# Altium schematic sheet MCU.SchDoc: MVU
size A3; DocumentNumber: 4; SheetNumber: 4; SheetTotal: 6
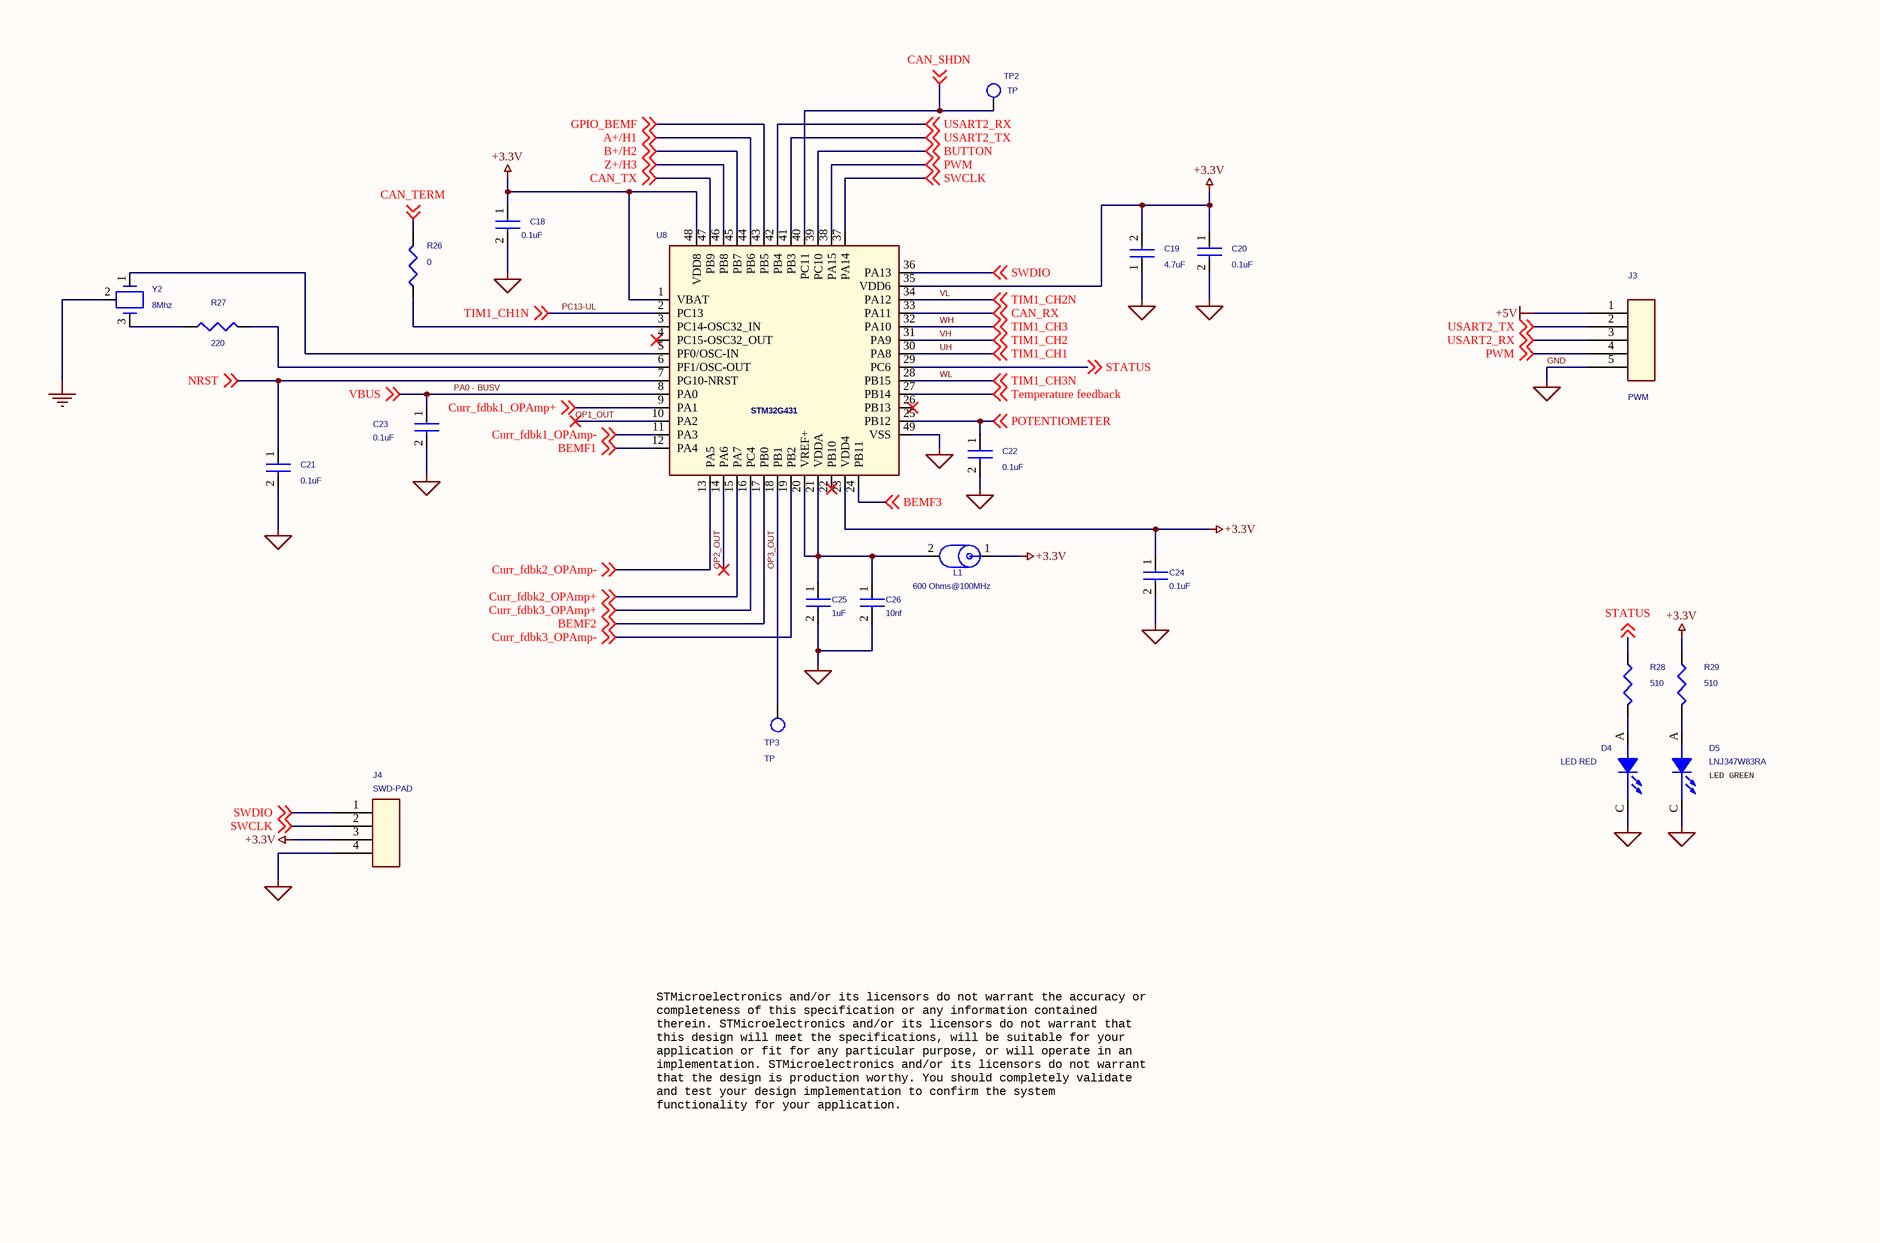
[diagram p0: MCU.SchDoc, top left]
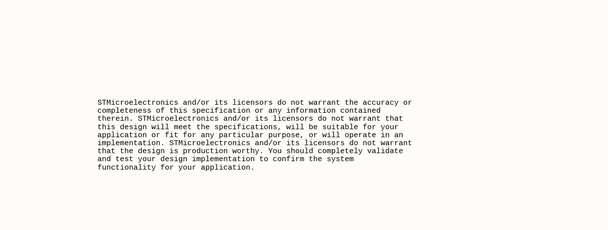
[diagram p1: MCU.SchDoc, bottom right]

## Parts
C18  0.1uF  [C_0402]
C19  4.7uF  [C_0603]
C20  0.1uF  [C_0402]
C21  0.1uF  [C_0402]
C22  0.1uF  [C_0402]
C23  0.1uF  [C_0402]
C24  0.1uF  [C_0402]
C25  1uF  [C_0402]
C26  10nf  [C_0402]
D4  LED RED  [D_0402_Led_red]
D5  LNJ347W83RA  [D_0402_Led_green]
J3  PWM  [SOLDER_PAD_5PIN_SMD]
J4  SWD-PAD  [SOLDER_PAD_4PIN_rect_SMD]
L1  600 Ohms@100MHz  [L_0402]
R26  0  [R_0402]
R27  220  [R_0402]
R28  510  [R_0402]
R29  510  [R_0402]
TP2  TP  [test_point_100_smd]
TP3  TP  [test_point_100_smd]
U8  STM32G431  [qfn49p50_700x700x60l40x25t560n]
Y2  8Mhz  [murata_cstce8m00g15c99-r0]

## Nets
+3.3V: C18.1 C19.2 C20.1 C24.1 J4.3 L1.1 R29.1 U8.1(VBAT) U8.23(VDD4) U8.35(VDD6) U8.48(VDD8)
+5V: J3.1
GND: C18.2 C19.1 C20.2 C21.2 C22.2 C23.2 C24.2 C25.2 C26.2 D4.C(CATHODE) D5.C(CATHODE) J3.5 J4.4 U8.49(VSS) Y2.2  [also labelled GND_SIGNAL]
A+/H1: U8.44(PB6) ; off-sheet A+/H1
B+/H2: U8.45(PB7) ; off-sheet B+/H2
BEMF1: U8.12(PA4) ; off-sheet BEMF1
BEMF2: U8.17(PB0) ; off-sheet BEMF2
BEMF3: U8.24(PB11) ; off-sheet BEMF3
BUTTON: U8.39(PC10) ; off-sheet BUTTON
CAN_RX: U8.33(PA11) ; off-sheet CAN_RX
CAN_SHDN: TP2.1 U8.40(PC11) ; off-sheet CAN_SHDN
CAN_TERM: R26.2 ; off-sheet CAN_TERM
CAN_TX: U8.47(PB9) ; off-sheet CAN_TX
Curr_fdbk1_OPAmp+: U8.9(PA1) ; off-sheet Curr_fdbk1_OPAmp+
Curr_fdbk1_OPAmp-: U8.11(PA3) ; off-sheet Curr_fdbk1_OPAmp-
Curr_fdbk2_OPAmp+: U8.15(PA7) ; off-sheet Curr_fdbk2_OPAmp+
Curr_fdbk2_OPAmp-: U8.13(PA5) ; off-sheet Curr_fdbk2_OPAmp-
Curr_fdbk3_OPAmp+: U8.16(PC4) ; off-sheet Curr_fdbk3_OPAmp+
Curr_fdbk3_OPAmp-: U8.19(PB2) ; off-sheet Curr_fdbk3_OPAmp-
GPIO_BEMF: U8.43(PB5) ; off-sheet GPIO_BEMF
NRST: C21.1 U8.7(PG10-NRST) ; off-sheet NRST
OP1_OUT: U8.10(PA2)
OP2_OUT: U8.14(PA6)
OP3_OUT: TP3.1 U8.18(PB1)
PA0 - BUSV: C23.1 U8.8(PA0) ; off-sheet VBUS  [also labelled VBUS]
PC13-UL: U8.2(PC13) ; off-sheet TIM1_CH1N  [also labelled TIM1_CH1N]
POTENTIOMETER: C22.1 U8.25(PB12) ; off-sheet POTENTIOMETER
PWM: J3.4 U8.38(PA15) ; off-sheet PWM
STATUS: R28.1 U8.29(PC6) ; off-sheet STATUS
SWCLK: J4.2 U8.37(PA14) ; off-sheet SWCLK
SWDIO: J4.1 U8.36(PA13) ; off-sheet SWDIO
Temperature feedback: U8.27(PB14) ; off-sheet Temperature feedback
UH: U8.30(PA8) ; off-sheet TIM1_CH1  [also labelled TIM1_CH1]
USART2_RX: J3.3 U8.42(PB4) ; off-sheet USART2_RX
USART2_TX: J3.2 U8.41(PB3) ; off-sheet USART2_TX
VH: U8.31(PA9) ; off-sheet TIM1_CH2  [also labelled TIM1_CH2]
VL: U8.34(PA12) ; off-sheet TIM1_CH2N  [also labelled TIM1_CH2N]
WH: U8.32(PA10) ; off-sheet TIM1_CH3  [also labelled TIM1_CH3]
WL: U8.28(PB15) ; off-sheet TIM1_CH3N  [also labelled TIM1_CH3N]
Z+/H3: U8.46(PB8) ; off-sheet Z+/H3
NetC25_1: C25.1 C26.1 L1.2 U8.20(VREF+) U8.21(VDDA)
NetD4_A: D4.A(ANODE) R28.2
NetD5_A: D5.A(ANODE) R29.2
NetR26_1: R26.1 U8.3(PC14-OSC32_IN)
NetR27_1: R27.1 Y2.3
NetR27_2: R27.2 U8.6(PF1/OSC-OUT)
NetU8_5: U8.5(PF0/OSC-IN) Y2.1

Not connected (* = marked no-connect by the designer): U8 4(PC15-OSC32_OUT)* 22(PB10)* 26(PB13)*

## Notes on the sheet
- (near D5) LED GREEN
- STMicroelectronics and/or its licensors do not warrant the accuracy or
  completeness of this specification or any information contained
  therein. STMicroelectronics and/or its licensors do not warrant that
  this design will meet the specifications, will be suitable for your
  application or fit for any particular purpose, or will operate in an
  implementation. STMicroelectronics and/or its licensors do not warrant
  that the design is production worthy. You should completely validate
  and test your design implementation to confirm the system
  functionality for your application.
- Title:
- Project:
- Size:
- Revision:
- Variant:
- A3
- -
- Date:
- Reference:
- Sheet:
- of

## Library data of the parts
C18 C22 = CAP_Dup1: CAP CER 0.1UF 16V X7R 0402; PART_NUMBER: CAP-00000053; Manufacturer: Wurth Electronics Inc.; Manufacturer PN: 885012205037; Dielectric Type: Capacitors; Tolerance: 10%; CLASS: DISCRETE; Package Size: 0402 (1005 Metric); Temperature Coefficient: X7R; Rated Voltage: 16V
C19 = CAP_Dup1: CAP CER 4.7UF 10V X5R 0603; Manufacturer PN: 885012106012; Manufacturer: Wurth Electronics Inc.; PART_NUMBER: TMP-414; CLASS: DISCRETE; Tolerance: 20%; Dielectric Type: Capacitors; Rated Voltage: 10V; Temperature Coefficient: X5R; Package Size: 0603 (1608 Metric)
C20 C21 C23 C24 = CAP_Dup1: CAP CER 0.1UF 16V X7R 0402; Manufacturer PN: 885012205037; Manufacturer: Wurth Electronics Inc.; PART_NUMBER: CAP-00000053; CLASS: DISCRETE; Tolerance: 10%; Dielectric Type: Capacitors; Rated Voltage: 16V; Temperature Coefficient: X7R; Package Size: 0402 (1005 Metric)
C25 = CAP_Dup1: CAP CER 1UF 25V X5R 0402; PART_NUMBER: CAP-00000006; Manufacturer: Murata Electronics North America; Manufacturer PN: GRM155R61E105KA12D; Dielectric Type: Capacitors; Tolerance: 10%; CLASS: DISCRETE; Package Size: 0402 (1005 Metric); Temperature Coefficient: X5R; Rated Voltage: 25V
C26 = CAP_Dup1: CAP CER 10000PF 16V X7R 0402; PART_NUMBER: TMP-422; Manufacturer: Wurth Electronics Inc.; Manufacturer PN: 885012205031; Dielectric Type: Capacitors; Tolerance: 10%; CLASS: DISCRETE; Package Size: 0402 (1005 Metric); Temperature Coefficient: X7R; Rated Voltage: 16V
D4 = LED: DIO, Rectangle with Flat Top, 1.00mm x 0.50mm, VLMS1500-GS08, 20mA, --, --, 0402 (1005 Metric); PART_NUMBER: DIO-00000003; Manufacturer: Vishay Semiconductor Opto Division; CLASS: DISCRETE; Package Size: 0402 (1005 Metric); Manufacturer PN: VLMS1500-GS08
D5 = LED: LED GREEN 0402 SMD; PART_NUMBER: TMP-187; Manufacturer: Panasonic Electronic Components; CLASS: DISCRETE; Package Size: 0402 (1005 Metric); Manufacturer PN: LNJ347W83RA
J3 = CON5: SOLDER PADS
J4 = CON4: SOLDER PADS
L1 = IND_FB: FERRITE BEAD 600 OHM 0402 1LN; Manufacturer PN: BLM15BX601SN1D; Manufacturer: Murata Electronics North America; PART_NUMBER: TMP-492; CLASS: DISCRETE; Package Size: 0402 (1005 Metric)
R26 = RES: RES SMD 0 OHM JUMPER 1/16W 0402; PART_NUMBER: RES-00000073; Manufacturer: Vishay Dale; Manufacturer PN: CRCW04020000Z0ED; Rated Power: 0.063W, 1/16W; CLASS: DISCRETE; Package Size: 0402 (1005 Metric); Temperature Coefficient: -; Tolerance: Jumper
R27 = RES: RES SMD 220 OHM 1% 1/16W 0402; PART_NUMBER: TMP-437; Manufacturer: Yageo; Manufacturer PN: RC0402FR-07220RL; Temperature Coefficient: 100ppm/C; Rated Power: 0.063W, 1/16W; CLASS: DISCRETE; Package Size: 0402 (1005 Metric); Tolerance: 1%
R28 R29 = RES: RES SMD 510 OHM 1% 1/16W 0402; PART_NUMBER: TMP-438; Manufacturer: Yageo; Manufacturer PN: RC0402FR-07510RL; Temperature Coefficient: 100ppm/C; Rated Power: 0.063W, 1/16W; CLASS: DISCRETE; Package Size: 0402 (1005 Metric); Tolerance: 1%
TP2 TP3 = TESTPOINT: TEST POINT 1MM  SMD PADSTASCK; PART_NUMBER: TMP-386; CLASS: IO
U8 = STM32_LQFP64_6
Y2 = resonator: CER RES 8.0000MHZ 33PF SMD; Manufacturer PN: CSTCE8M00G15C99-R0; Manufacturer: Murata Electronics North America; PART_NUMBER: TMP-382; CLASS: DISCRETE; Frequency Tolerance: 0.1%; Frequency Stability: 0.13%; Package Size: 0.126" L x 0.051" W (3.20mm x 1.30mm)